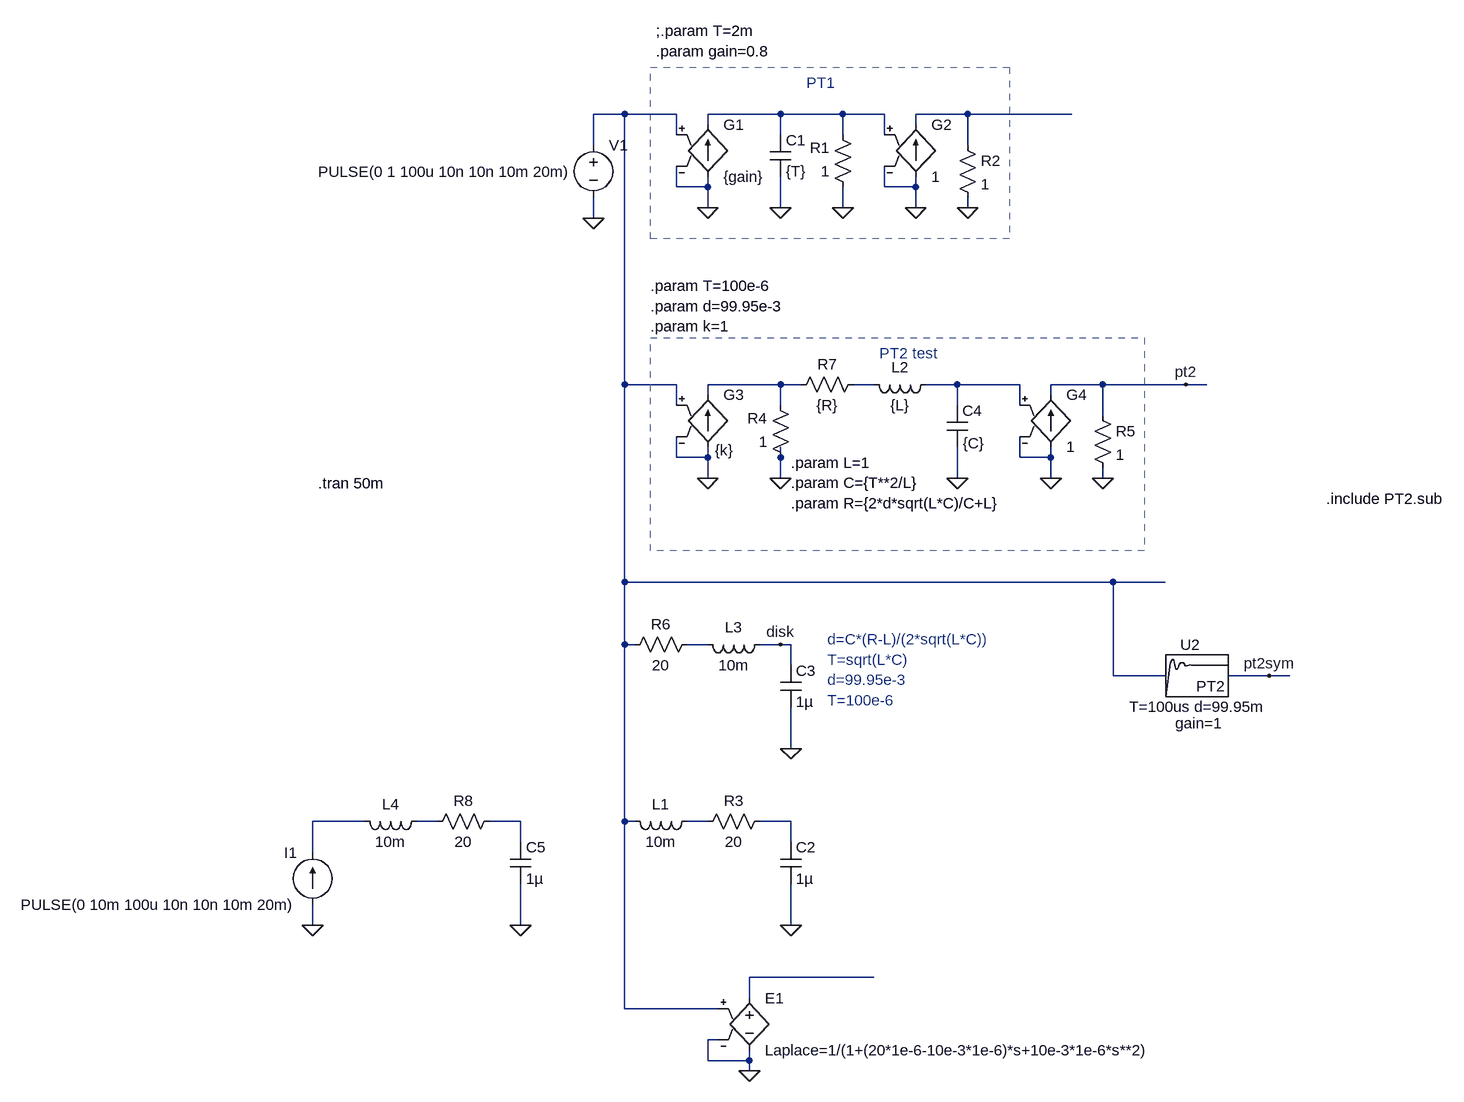
[diagram p0: schematic PT1_PT2_b.asc]
PT1_PT2_b.asc, the LTspice schematic file:
Version 4
SHEET 1 880 1012
WIRE -1136 -480 -1184 -480
WIRE -1056 -480 -1136 -480
WIRE -896 -480 -1008 -480
WIRE -800 -480 -896 -480
WIRE -736 -480 -800 -480
WIRE -608 -480 -688 -480
WIRE -448 -480 -608 -480
WIRE -1008 -464 -1008 -480
WIRE -688 -464 -688 -480
WIRE -1056 -448 -1056 -480
WIRE -896 -448 -896 -480
WIRE -800 -448 -800 -480
WIRE -736 -448 -736 -480
WIRE -1184 -432 -1184 -480
WIRE -608 -432 -608 -480
WIRE -1056 -368 -1056 -400
WIRE -1008 -368 -1008 -384
WIRE -1008 -368 -1056 -368
WIRE -736 -368 -736 -400
WIRE -688 -368 -688 -384
WIRE -688 -368 -736 -368
WIRE -1008 -336 -1008 -368
WIRE -896 -336 -896 -384
WIRE -800 -336 -800 -368
WIRE -688 -336 -688 -368
WIRE -608 -336 -608 -352
WIRE -1184 -320 -1184 -352
WIRE -1136 -64 -1136 -480
WIRE -1056 -64 -1136 -64
WIRE -896 -64 -1008 -64
WIRE -864 -64 -896 -64
WIRE -752 -64 -784 -64
WIRE -624 -64 -672 -64
WIRE -528 -64 -624 -64
WIRE -400 -64 -480 -64
WIRE -272 -64 -400 -64
WIRE -240 -64 -272 -64
WIRE -1008 -48 -1008 -64
WIRE -480 -48 -480 -64
WIRE -1056 -32 -1056 -64
WIRE -896 -32 -896 -64
WIRE -624 -32 -624 -64
WIRE -528 -32 -528 -64
WIRE -400 -16 -400 -64
WIRE -1056 48 -1056 16
WIRE -1008 48 -1008 32
WIRE -1008 48 -1056 48
WIRE -896 48 -896 32
WIRE -528 48 -528 16
WIRE -480 48 -480 32
WIRE -480 48 -528 48
WIRE -1008 80 -1008 48
WIRE -896 80 -896 48
WIRE -624 80 -624 32
WIRE -480 80 -480 48
WIRE -400 80 -400 64
WIRE -1136 240 -1136 -64
WIRE -384 240 -1136 240
WIRE -304 240 -384 240
WIRE -1136 336 -1136 240
WIRE -1120 336 -1136 336
WIRE -1008 336 -1040 336
WIRE -896 336 -928 336
WIRE -880 336 -896 336
WIRE -880 368 -880 336
WIRE -384 384 -384 240
WIRE -304 384 -384 384
WIRE -144 384 -208 384
WIRE -112 384 -144 384
WIRE -880 496 -880 432
WIRE -1536 608 -1616 608
WIRE -1424 608 -1456 608
WIRE -1296 608 -1344 608
WIRE -1136 608 -1136 336
WIRE -1120 608 -1136 608
WIRE -1008 608 -1040 608
WIRE -880 608 -928 608
WIRE -1296 640 -1296 608
WIRE -880 640 -880 608
WIRE -1616 656 -1616 608
WIRE -1616 768 -1616 736
WIRE -1296 768 -1296 704
WIRE -880 768 -880 704
WIRE -752 848 -944 848
WIRE -944 880 -944 848
WIRE -1136 896 -1136 608
WIRE -992 896 -1136 896
WIRE -992 944 -1008 944
WIRE -1008 976 -1008 944
WIRE -944 976 -944 960
WIRE -944 976 -1008 976
WIRE -944 992 -944 976
FLAG -896 -336 0
FLAG -1008 -336 0
FLAG -688 -336 0
FLAG -800 -336 0
FLAG -608 -336 0
FLAG -1184 -320 0
FLAG -880 768 0
FLAG -1008 80 0
FLAG -480 80 0
FLAG -896 80 0
FLAG -400 80 0
FLAG -944 992 0
FLAG -880 496 0
FLAG -624 80 0
FLAG -144 384 pt2sym
FLAG -272 -64 pt2
FLAG -896 336 disk
FLAG -1296 768 0
FLAG -1616 768 0
SYMBOL res -784 -352 R180
WINDOW 0 36 76 Left 2
WINDOW 3 36 40 Left 2
SYMATTR InstName R1
SYMATTR Value 1
SYMBOL cap -912 -448 R0
SYMATTR InstName C1
SYMATTR Value {T}
SYMBOL g -1008 -480 R0
SYMATTR InstName G1
SYMATTR Value {gain}
SYMBOL g -688 -480 R0
SYMATTR InstName G2
SYMATTR Value 1
SYMBOL res -624 -448 R0
SYMATTR InstName R2
SYMATTR Value 1
SYMBOL voltage -1184 -448 R0
WINDOW 3 -424 57 Left 2
WINDOW 123 0 0 Left 2
WINDOW 39 0 0 Left 2
SYMATTR Value PULSE(0 1 100u 10n 10n 10m 20m)
SYMATTR InstName V1
SYMBOL res -912 592 R90
WINDOW 0 0 56 VBottom 2
WINDOW 3 32 56 VTop 2
SYMATTR InstName R3
SYMATTR Value 20
SYMBOL ind -1024 592 R90
WINDOW 0 5 56 VBottom 2
WINDOW 3 32 56 VTop 2
SYMATTR InstName L1
SYMATTR Value 10m
SYMBOL cap -896 640 R0
SYMATTR InstName C2
SYMATTR Value 1µ
SYMBOL res -880 64 R180
WINDOW 0 36 76 Left 2
WINDOW 3 36 40 Left 2
SYMATTR InstName R4
SYMATTR Value 1
SYMBOL g -1008 -64 R0
WINDOW 3 11 101 Left 2
SYMATTR Value {k}
SYMATTR InstName G3
SYMBOL g -480 -64 R0
SYMATTR InstName G4
SYMATTR Value 1
SYMBOL res -416 -32 R0
SYMATTR InstName R5
SYMATTR Value 1
SYMBOL ind -656 -80 R90
WINDOW 0 5 56 VBottom 2
WINDOW 3 32 56 VTop 2
SYMATTR InstName L2
SYMATTR Value {L}
SYMBOL e -944 864 R0
SYMATTR InstName E1
SYMATTR Value Laplace=1/(1+(20*1e-6-10e-3*1e-6)*s+10e-3*1e-6*s**2)
SYMBOL res -1024 320 R90
WINDOW 0 0 56 VBottom 2
WINDOW 3 32 56 VTop 2
SYMATTR InstName R6
SYMATTR Value 20
SYMBOL ind -912 320 R90
WINDOW 0 5 56 VBottom 2
WINDOW 3 32 56 VTop 2
SYMATTR InstName L3
SYMATTR Value 10m
SYMBOL cap -896 368 R0
SYMATTR InstName C3
SYMATTR Value 1µ
SYMBOL cap -640 -32 R0
WINDOW 3 25 58 Left 2
SYMATTR Value {C}
SYMATTR InstName C4
SYMBOL res -768 -80 R90
WINDOW 0 0 56 VBottom 2
WINDOW 3 32 56 VTop 2
SYMATTR InstName R7
SYMATTR Value {R}
SYMBOL pt2 -256 384 R0
SYMATTR Value T=100us d=99.95m
SYMATTR InstName U2
SYMBOL res -1328 592 R90
WINDOW 0 0 56 VBottom 2
WINDOW 3 32 56 VTop 2
SYMATTR InstName R8
SYMATTR Value 20
SYMBOL ind -1440 592 R90
WINDOW 0 5 56 VBottom 2
WINDOW 3 32 56 VTop 2
SYMATTR InstName L4
SYMATTR Value 10m
SYMBOL cap -1312 640 R0
SYMATTR InstName C5
SYMATTR Value 1µ
SYMBOL current -1616 736 R180
WINDOW 0 24 80 Left 2
WINDOW 3 24 0 Left 2
WINDOW 123 0 0 Left 2
WINDOW 39 0 0 Left 2
SYMATTR InstName I1
SYMATTR Value PULSE(0 10m 100u 10n 10n 10m 20m)
TEXT -1088 -608 Left 2 !;.param T=2m\n.param gain=0.8
TEXT -856 -528 Left 2 ;PT1
TEXT -1608 88 Left 2 !.tran 50m
TEXT -744 -112 Left 2 ;PT2 test
TEXT -1096 -216 Left 2 !.param T=100e-6\n.param d=99.95e-3\n.param k=1
TEXT -824 328 Left 2 ;d=C*(R-L)/(2*sqrt(L*C))\nT=sqrt(L*C)\nd=99.95e-3\nT=100e-6
TEXT -880 56 Left 2 !.param L=1\n.param C={T**2/L}\n.param R={2*d*sqrt(L*C)/C+L}
TEXT -56 112 Left 2 !.include PT2.sub
RECTANGLE Normal -544 -288 -1096 -552 2
RECTANGLE Normal -336 192 -1096 -136 2

The netlist it stands for:
* PT1_PT2_b.asc
R1 0 N002 1
C1 N002 0 {T}
G1 0 N002 N001 0 {gain}
G2 0 N003 N002 0 1
R2 N003 0 1
V1 N001 0 PULSE(0 1 100u 10n 10n 10m 20m)
R3 N012 N011 20
L1 N011 N001 10m
C2 N012 0 1µ
R4 0 N004 1
G3 0 N004 N001 0 {k}
G4 0 pt2 N006 0 1
R5 pt2 0 1
L2 N006 N005 {L}
E1 N013 0 N001 0 Laplace=1/(1+(20*1e-6-10e-3*1e-6)*s+10e-3*1e-6*s**2)
R6 N007 N001 20
L3 disk N007 10m
C3 disk 0 1µ
C4 N006 0 {C}
R7 N005 N004 {R}
XU2 N001 pt2sym PT2 T=100us d=99.95m gain=1  ; pins 1 2
R8 N010 N009 20
L4 N009 N008 10m
C5 N010 0 1µ
I1 0 N008 PULSE(0 10m 100u 10n 10n 10m 20m)
;.param T=2m
.param gain=0.8
* PT1
.tran 50m
* PT2 test
.param T=100e-6
.param d=99.95e-3
.param k=1
* d=C*(R-L)/(2*sqrt(L*C))
* T=sqrt(L*C)
* d=99.95e-3
* T=100e-6
.param L=1
.param C={T**2/L}
.param R={2*d*sqrt(L*C)/C+L}
.include PT2.sub
.lib PT1.sub
.backanno
.end